# EAGLE design TwinSensorRevC (EAGLE 7.6.0)
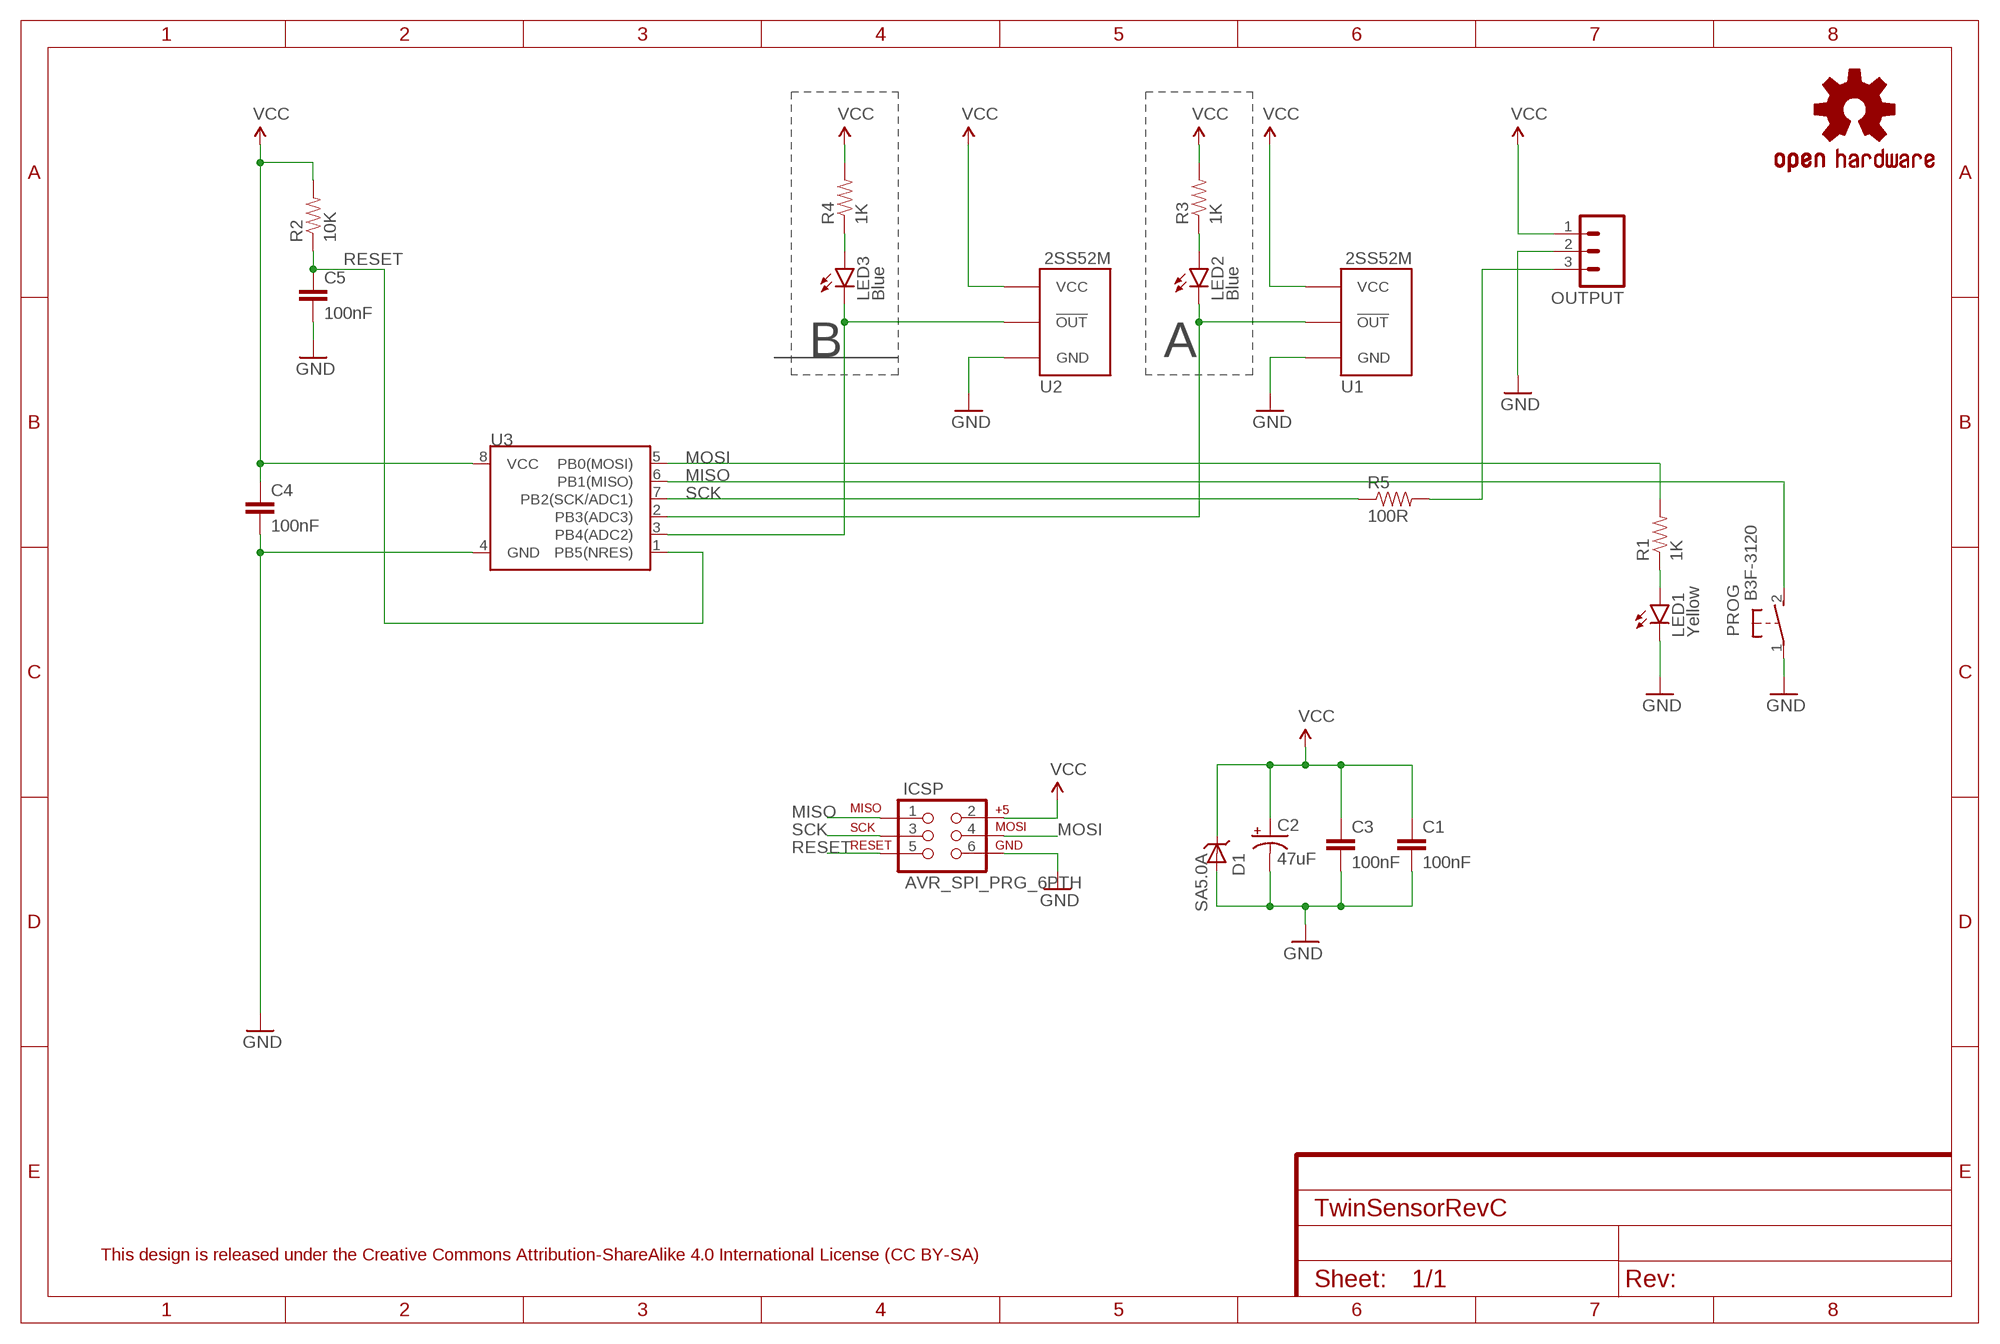
[diagram p0: schematic, sheet 1]
FRAME1 (FRAME-A4L): CNAME: Twin Sensor Board; CREVISION: C 08/2016; DESIGNER: Andrew Instone-Cowie

## Parts
C1  100nF  CAPPTH  [CAP-PTH-SMALL]
C2  47uF  CAP_POLPTH1  [CPOL-RADIAL-100UF-25V]
C3  100nF  CAPPTH  [CAP-PTH-SMALL]
C4  100nF  CAPPTH  [CAP-PTH-SMALL]
C5  100nF  CAPPTH  [CAP-PTH-SMALL]
D1  SA5.0A  [DO41_TVS_UNI]
ICSP  AVR_SPI_PRG_6PTH  [2X3]
LED1  Yellow  LED3MM  [LED3MM]
LED2  Blue  LED3MM  [LED3MM]
LED3  Blue  LED3MM  [LED3MM]
LOGO1  OSHW-LOGOS  [OSHW-LOGO-S]
OUTPUT  M03PTH  [1X03]
PROG  B3F-3120  [B3F-3120]
R1  1K  RESISTORPTH-1/4W  [AXIAL-0.4]
R2  10K  RESISTORPTH-1/4W  [AXIAL-0.4]
R3  1K  RESISTORPTH-1/4W  [AXIAL-0.4]
R4  1K  RESISTORPTH-1/4W  [AXIAL-0.4]
R5  100R  RESISTORPTH-1/4W  [AXIAL-0.4]
U1  2SS52MVERT  [2SS52M_VERT]
U2  2SS52MVERT  [2SS52M_VERT]
U3  ATTINY45DIL08_LONG_PADS  [DIL08]

## Nets
GND: C1.2 C2.2(-) C3.2 C4.2 C5.2 D1.ANODE ICSP.6 LED1.K(C) OUTPUT.2 PROG.1(P) U1.P$1(GND) U2.P$1(GND) U3.4(GND)
MISO: ICSP.1 PROG.2(S) U3.6(PB1(MISO))
MOSI: ICSP.4 R1.P$2 U3.5(PB0(MOSI))
N$1: LED2.A R3.P$1
N$2: LED3.A R4.P$1
N$6: LED1.A R1.P$1
N$7: LED2.K(C) U1.P$2(!OUT!) U3.2(PB3(ADC3))
N$8: LED3.K(C) U2.P$2(!OUT!) U3.3(PB4(ADC2))
OUT: OUTPUT.3 R5.P$2
RESET: C5.1 ICSP.5 R2.P$1 U3.1(PB5(NRES))
SCK: ICSP.3 R5.P$1 U3.7(PB2(SCK/ADC1))
VCC: C1.1 C2.1(+) C3.1 C4.1 D1.CATHODE ICSP.2 OUTPUT.1 R2.P$2 R3.P$2 R4.P$2 U1.P$3(VCC) U2.P$3(VCC) U3.8(VCC)

## Notes on the sheet
- B | A
- This design is released under the Creative Commons Attribution-ShareAlike 4.0 International License (CC BY-SA)

## Library data of the parts
C1 C3-C5 = SparkFun-Passives:CAP: Capacitor Standard 0603 ceramic capacitor, and 0.1" leaded capacitor.
C2 = SparkFun-Passives:CAP_POL: Capacitor Polarized These are standard SMD and PTH capacitors. Normally 10uF, 47uF, and 100uF in electrolytic and tantalum varieties. Always verify the external diameter of the through hole cap, it varies with capacity, voltage, and manufacturer. The EIA devices should be standard.
D1 = AIC_Custom:SA5.0A: SA5.0CA TVS Uni-Directional Transient Voltage Suppressor. 5V, DO41 package
ICSP = SparkFun-Connectors:AVR_SPI_PRG_6: AVR ISP 6 Pin This is the reduced ISP connector for AVR programming. Common on Arduino. This footprint will take up less PCB space and can be used with a 10-pin to 6-pin adapter such as SKU: BOB-08508 **Special note about "TEST_POINT" package. The stop mask is on the top side, so if you want your programming test points to be on the bottom of your board, make sure to place this package on the bottom side of the board. This also ensure that the orientation to program from the bottom side will be correct.
LED1-LED3 = SparkFun-LED:LED: LEDs Standard schematic elements and footprints for 5mm, 3mm, 1206, and 0603 sized LEDs. 5mm - Spark Fun Electronics SKU : COM-00529 (and others)
LOGO1 = SparkFun-Aesthetics:OSHW-LOGO: Open Source Hardware Logo This logo indicates the piece of hardware it is found on incorporates a OSHW license and/or adheres to the definition of open source hardware found here: http://freedomdefined.org/OSHW
OUTPUT = SparkFun-Connectors:M03: Header 3 Standard 3-pin 0.1" header. Use with straight break away headers (SKU : PRT-00116), right angle break away headers (PRT-00553), swiss pins (PRT-00743), machine pins (PRT-00117), and female headers (PRT-00115). Molex polarized connector foot print use with SKU : PRT-08232 with associated crimp pins and housings.
PROG = AIC_Custom:B3F-3120: OMRON SWITCH; MPN: B3F-3100; OC_FARNELL: 959704; OC_NEWARK: 36M3582
R1-R5 = SparkFun-Passives:RESISTOR: Resistor Basic schematic elements and footprints for 0603, 1206, and PTH resistors.
U1 U2 = AIC_Custom:2SS52M: Honeywell 2SS52M Magnetoresistive Detector
U3 = AIC_Custom:ATTINY45: Atmel 8-pin 2/4/8kB flash uC

## Board
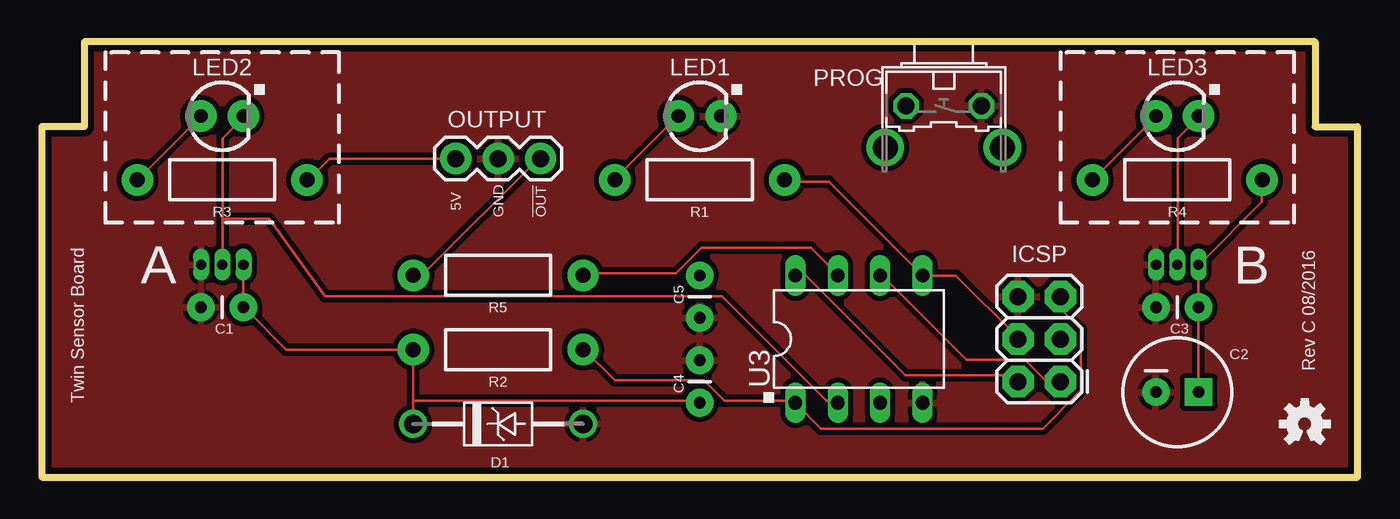
[diagram p1: board, top side]
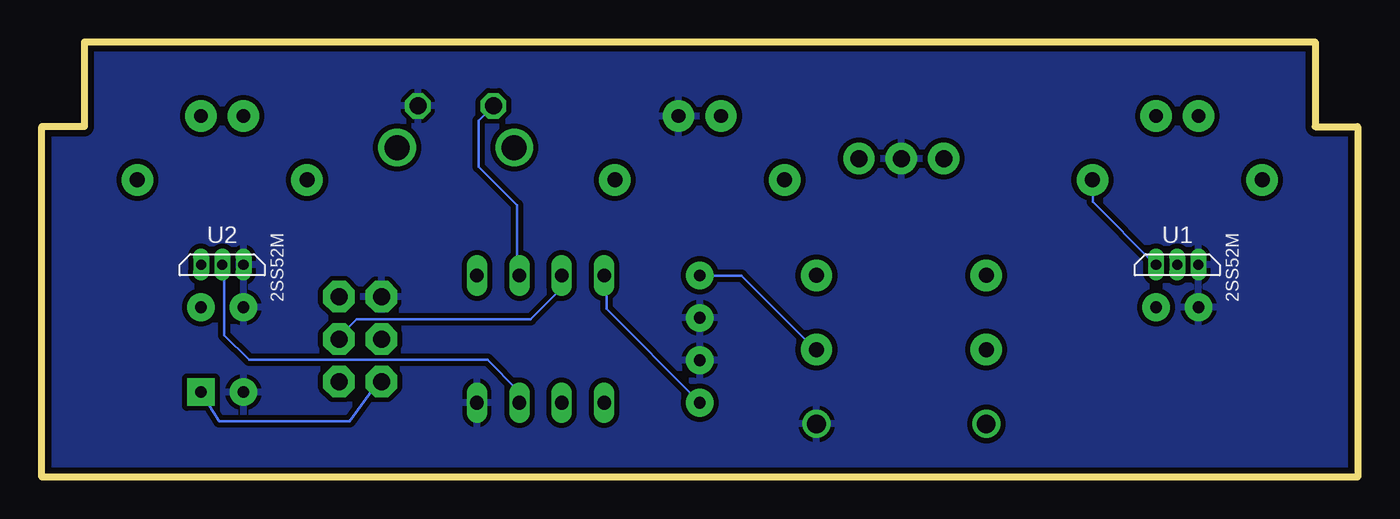
[diagram p2: board, bottom side, seen from below]

Size 78.74 x 26.04 mm. Coordinates in mm from the lower left corner, seen from the top.
Outline: 0,0 78.74,0 78.74,20.95 76.2,20.95 76.2,26.04 2.54,26.04 2.54,20.95 0,20.95 0,0
Copper layers (1*16): Top 0.0356mm / dielectric 1.5011mm / Bottom 0.0356mm
Design rules "LaenPCBOrder(OSHPARK)": minimum track width 6mil, minimum drill 13mil, track to track 6mil, track to pad 6mil, pad to pad 6mil, via to via 6mil, smd to smd 6mil, copper to edge 15mil, drill to drill 6mil, minimum pad ring 7mil, minimum via ring 7mil, stop-mask expansion 3mil, vias tented up to drill 0mil, thermal gap 10mil

### Footprints (pad centres in the part's own frame; a part is rotated, then mirrored left to right if it is on the bottom)
CAP-PTH-SMALL = drill 0.7 pad 1.651: 1 0,0; 2 2.54,0
CPOL-RADIAL-100UF-25V = drill 0.7 pad 1.651 square: 1 1.27,0 | drill 0.7 pad 1.651: 2 -1.27,0
DO41_TVS_UNI = drill 1.118: ANODE -5.08,0; CATHODE 5.08,0
2X3 = drill 1.016 pad 1.88 octagon: 1 0,0; 2 0,2.54; 3 2.54,0; 4 2.54,2.54; 5 5.08,0; 6 5.08,2.54
LED3MM = drill 0.813 pad 1.88: A -1.27,0; K 1.27,0
1X03 = drill 1.016 pad 1.88: 1 0,0; 2 2.54,0; 3 5.08,0
B3F-3120 = drill 1.016 octagon: 1 -2.261,-1.245; 2 2.261,-1.245 | drill 1.499 pad 2.159: 3 -3.505,1.245; 4 3.505,1.245
AXIAL-0.4 = drill 0.9 pad 1.88: P$1 -5.08,0; P$2 5.08,0
2SS52M_VERT = drill 0.6 pad 0.813 long: P$1 0,1.27; P$2 0,0; P$3 0,-1.27
DIL08 = drill 0.813 long: 1 -3.81,-3.81; 2 -1.27,-3.81; 3 1.27,-3.81; 4 3.81,-3.81; 5 3.81,3.81; 6 1.27,3.81; 7 -1.27,3.81; 8 -3.81,3.81

### Placement (x,y rotation side)
C1  12.06,10.16 180 top
C2  67.94,5.08 0 top
C3  69.22,10.16 180 top
C4  39.37,4.45 90 top
C5  39.37,12.06 270 top
D1  27.3,3.17 180 top
ICSP  60.96,5.71 90 top
LED1  39.37,21.59 0 top
LED2  10.79,21.59 0 top
LED3  67.94,21.59 0 top
LOGO1  75.56,3.17 0 top
OUTPUT  24.77,19.05 0 top
PROG  53.98,20.95 180 top
R1  39.37,17.78 0 top
R2  27.3,7.62 180 top
R3  10.79,17.78 0 top
R4  67.94,17.78 0 top
R5  27.3,12.06 180 top
U1  10.79,12.7 270 bottom
U2  67.94,12.7 270 bottom
U3  48.9,8.26 0 top

### Tracks (layer width: path | path; a pad name or v marks a point on that pad's centre or on a via)
GND
  pour Bottom (isolate 0.305): 2.54,26.04 2.54,20.95 0,20.95 0,0 78.74,0 78.74,20.95 76.2,20.95 76.2,26.04
  pour Top (isolate 0.305): 2.54,26.04 2.54,20.95 0,20.95 0,0 78.74,0 78.74,20.95 76.2,20.95 76.2,26.04
MISO
  Top 0.152: ICSP.1 60.96,5.79 60.05,5.79 58.83,7.01 55.32,7.01 50.29,12.04 U3.6
  Bottom 0.152: PROG.2 52.6,21.31 52.6,18.57 50.29,16.26 50.29,12.19 U3.6
MOSI
  Top 0.152: ICSP.4 58.37,8.38 54.71,12.04 52.73,12.04 U3.5 47.09,17.68 44.5,17.68 R1.P$2
N$1
  Top 0.152: R3.P$1 5.79,17.83 9.45,21.49 LED2.A
N$2
  Top 0.152: R4.P$1 62.94,17.83 66.6,21.49 LED3.A
N$6
  Top 0.152: R1.P$1 34.29,17.83 38.1,21.64 LED1.A
N$7
  Top 0.152: 10.82,15.44 10.82,20.27 12.04,21.49 LED2.K | 10.82,15.44 10.82,12.8 U1.P$2 | 10.82,15.44 13.61,15.44 16.97,10.82 40.69,10.82 46.94,4.57 47.55,4.57 U3.2
N$8
  Top 0.152: U2.P$2 67.97,12.8 67.97,20.27 69.19,21.49 LED3.K
  Bottom 0.152: U3.3 50.29,4.57 50.27,5.21 52.07,7.01 66.34,7.01 67.82,8.48 67.82,12.65 U2.P$2
OUT
  Top 0.152: R5.P$2 22.25,12.19 22.86,12.19 29.72,19.05 OUTPUT.3
RESET
  Top 0.152: R2.P$1 32.46,7.62 34.29,5.79 39.62,5.79 40.84,4.57 44.96,4.57 U3.1 46.63,2.9 59.89,2.9 62.18,5.18 62.18,8.84 60.96,10.06 ICSP.5
  Bottom 0.152: C5.1 39.32,12.04 36.88,12.04 32.46,7.62 R2.P$1
SCK
  Top 0.152: R5.P$1 32.46,12.19 37.95,12.19 39.47,13.72 46.02,13.72 47.55,12.19 U3.7
  Bottom 0.152: ICSP.3 60.96,8.38 59.89,9.45 49.48,9.45 47.62,11.3 U3.7
VCC
  Top 0.152: 22.25,7.62 R2.P$2 | U1.P$3 12.04,12.65 12.04,10.21 C1.1 12.19,10.06 14.63,7.62 R2.P$2 | OUTPUT.1 17.22,19.05 16,17.83 R3.P$2 | C2.1 69.19,5.18 69.19,10.06 C3.1 69.19,10.21 69.19,12.65 U2.P$3 69.34,12.8 73,16.46 73,17.68 R4.P$2 | U3.8 45.11,12.04 45.72,12.04 51.66,6.1 58.06,6.1 58.37,5.79 ICSP.2 | C4.1 39.32,4.57 23.52,4.57 22.23,4.57 | 22.23,4.57 D1.CATHODE | 22.23,4.57 R2.P$2
  Bottom 0.152: R3.P$2 15.85,17.68 15.85,16.46 12.19,12.8 U1.P$3 | U3.8 44.96,12.04 44.96,10.06 39.47,4.57 C4.1 | ICSP.2 58.52,5.64 58.65,5.64 60.33,3.33 68.12,3.33 69.19,5.03 C2.1

### Text on the board
tPlace: 5V / / GND / / !OUT! | A | B | Rev C 08/2016 | Twin Sensor Board